# EAGLE design FireFaderRev1 (EAGLE 6.4)
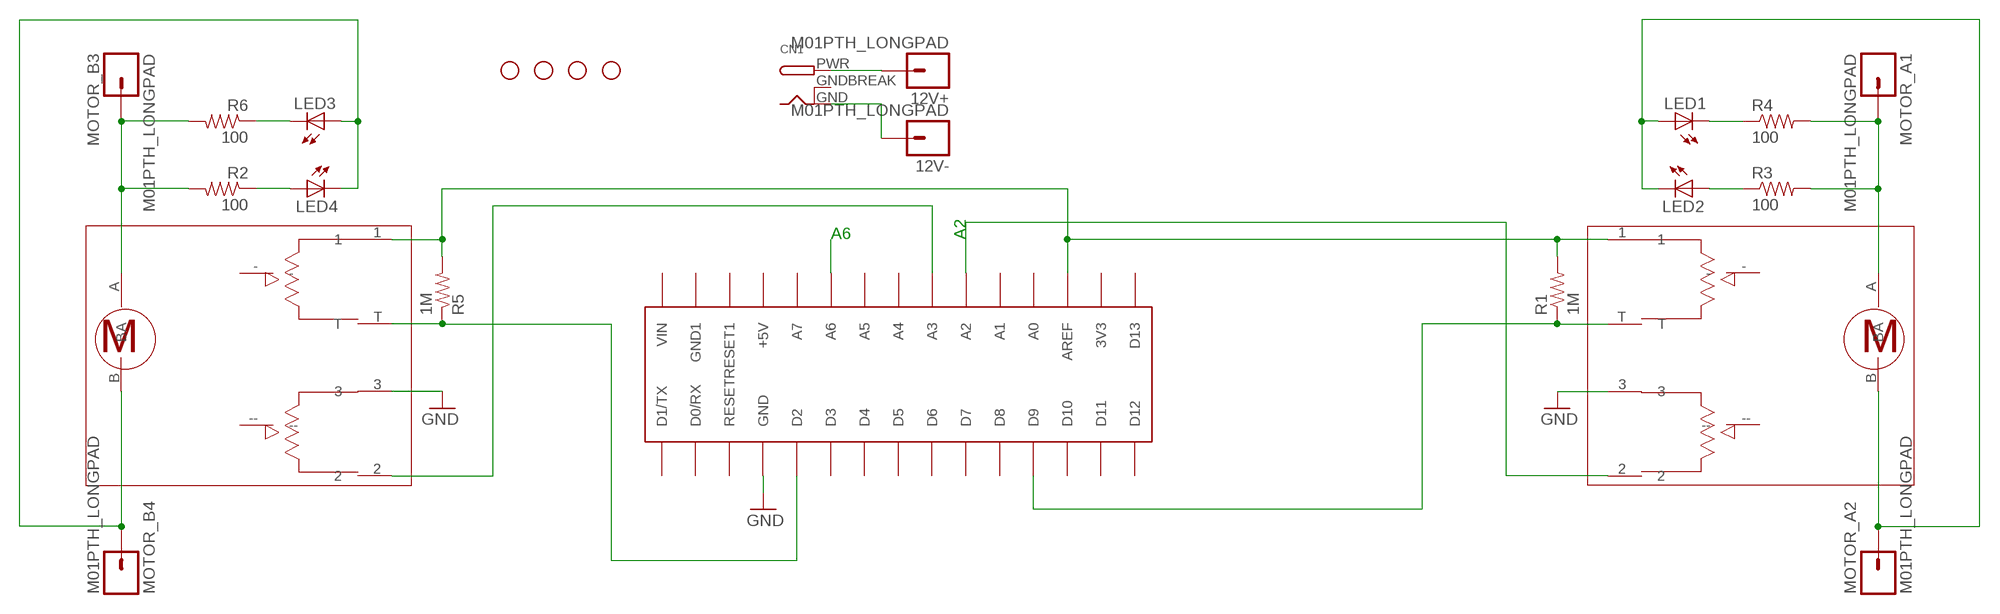
[diagram p0: schematic, sheet 1]

## Parts
12V+  M01PTH_LONGPAD  [1X01_LONGPAD]
12V-  M01PTH_LONGPAD  [1X01_LONGPAD]
CN1  DCBARRELPTH  [DCJACK_2MM_PTH]
LED1  LED5MM  [LED5MM]
LED2  LED5MM  [LED5MM]
LED3  LED5MM  [LED5MM]
LED4  LED5MM  [LED5MM]
MOTOR_A1  M01PTH_LONGPAD  [1X01_LONGPAD]
MOTOR_A2  M01PTH_LONGPAD  [1X01_LONGPAD]
MOTOR_B3  M01PTH_LONGPAD  [1X01_LONGPAD]
MOTOR_B4  M01PTH_LONGPAD  [1X01_LONGPAD]
R1  1M  RESISTORPTH-1/4W  [AXIAL-0.4]
R2  100  RESISTORPTH-1W  [AXIAL-0.6]
R3  100  RESISTORPTH-1W  [AXIAL-0.6]
R4  100  RESISTORPTH-1W  [AXIAL-0.6]
R5  1M  RESISTORPTH-1/4W  [AXIAL-0.4]
R6  100  RESISTORPTH-1W  [AXIAL-0.6]
STANDOFF1  STAND-OFF  [STAND-OFF]
STANDOFF2  STAND-OFF  [STAND-OFF]
STANDOFF3  STAND-OFF  [STAND-OFF]
STANDOFF4  STAND-OFF  [STAND-OFF]
U$1  ARDUINONANO  [PDIP-32]
U$2  ALPS-RSA0N11M9A07  [MF-MOTORFADER-ALPS]
U$3  ALPS-RSA0N11M9A07  [MF-MOTORFADER-ALPS]

## Nets
A1: U$1.A3 U$3.2
A2: U$1.A2 U$2.2
A6: U$1.A6
AREF: R1.P$2 R5.P$2 U$1.AREF U$2.1 U$3.1
GND: U$1.GND U$2.3 U$3.3
MA1: MOTOR_A1.1 R3.P$2 R4.P$2 U$2.A
MA2: LED1.A LED2.K(C) MOTOR_A2.1 U$2.B
MB3: MOTOR_B3.1 R2.P$2 R6.P$2 U$3.A
MB4: LED3.A LED4.K(C) MOTOR_B4.1 U$3.B
N$1: LED2.A R3.P$1
N$2: LED1.K(C) R4.P$1
N$7: R1.P$1 U$1.D9 U$2.T
N$9: 12V-.1 CN1.GND
N$10: 12V+.1 CN1.PWR
N$13: R5.P$1 U$1.D2 U$3.T
N$15: LED4.A R2.P$1
N$16: LED3.K(C) R6.P$1
Unconnected: U$1.3V3 U$1.+5V U$1.A0 U$1.A1 U$1.A4 U$1.A5 U$1.A7 U$1.D0/RX U$1.D1/TX U$1.D3 U$1.D4 U$1.D5 U$1.D6 U$1.D7 U$1.D8 U$1.D10 U$1.D11 U$1.D12 U$1.D13 U$1.GND1 U$1.RESET U$1.RESET1 U$1.VIN U$2.- U$2.-- U$3.- U$3.--

## Notes on the sheet
- A6 | A2

## Power pins joined to a net without a drawn wire
GNDBREAK: CN1.GNDBREAK

## Library data of the parts
12V+ 12V- MOTOR_A1 MOTOR_A2 MOTOR_B3 MOTOR_B4 = SparkFun-Connectors:M01: Header 1 Standard 1-pin 0.1" header. Use with straight break away headers (SKU : PRT-00116), right angle break away headers (PRT-00553), swiss pins (PRT-00743), machine pins (PRT-00117), and female headers (PRT-00115).
CN1 = adafruit:DCBARREL: 2.0mm DC Barrel Jack DCJACK_2MM_PTH - Through Hole Jack (4UConnector: 05537)
LED1-LED4 = SparkFun-LED:LED: LEDs Standard schematic elements and footprints for 5mm, 3mm, 1206, and 0603 sized LEDs. 5mm - Spark Fun Electronics SKU : COM-00529 (and others)
R1-R6 = SparkFun-Passives:RESISTOR: Resistor Basic schematic elements and footprints for 0603, 1206, and PTH resistors.
STANDOFF1-STANDOFF4 = SparkFun-Electromechanical:STAND-OFF: #4 Stand Off This is the mechanical footprint for a #4 phillips button head screw. Use the keepout ring to avoid running the screw head into surrounding components. SKU : PRT-00447
U$1 = jet-lib-fixed:ARDUINONANO
U$2 U$3 = ALPS-Motorfader:ALPS-RSA0N11M9A07: ALPS RSA0N11M9A07 100mm 10KOHM B Touchsensitiv Motorfader Datasheet: http://www.alps.com/WebObjects/catalog.woa/E/HTML/Potentiometer/SlidePotentiometers/RSN1M/RSA0N11M9A07.html

## Board
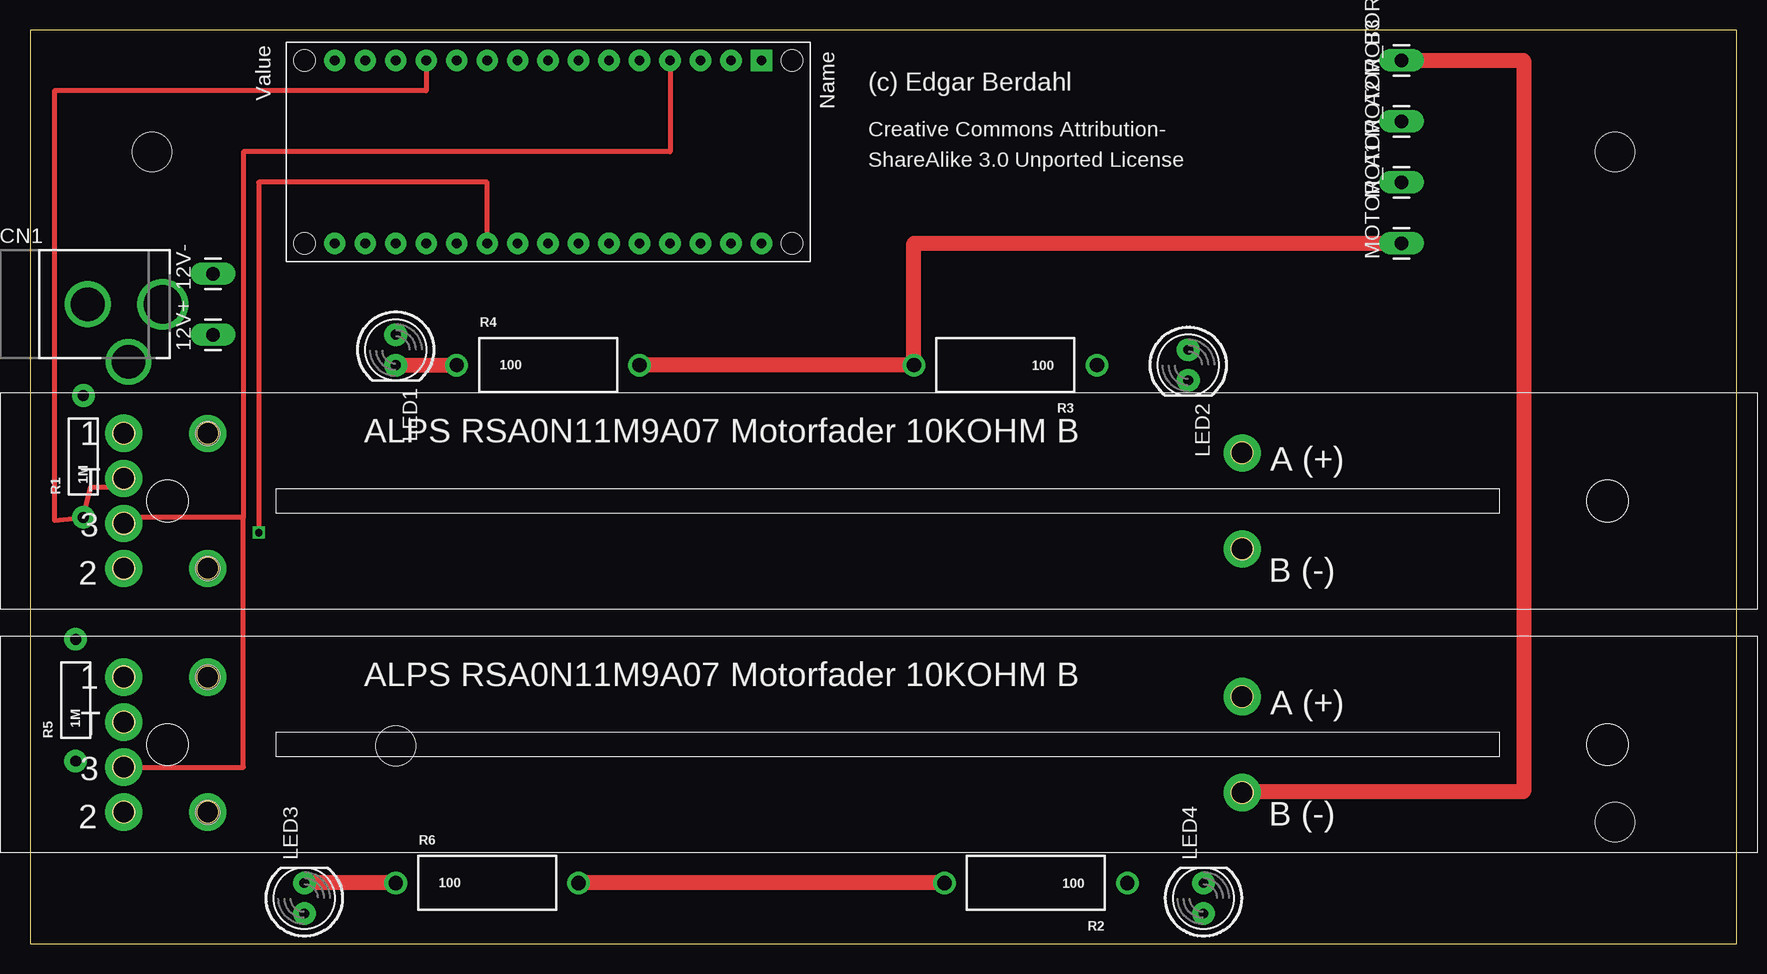
[diagram p1: board, top side]
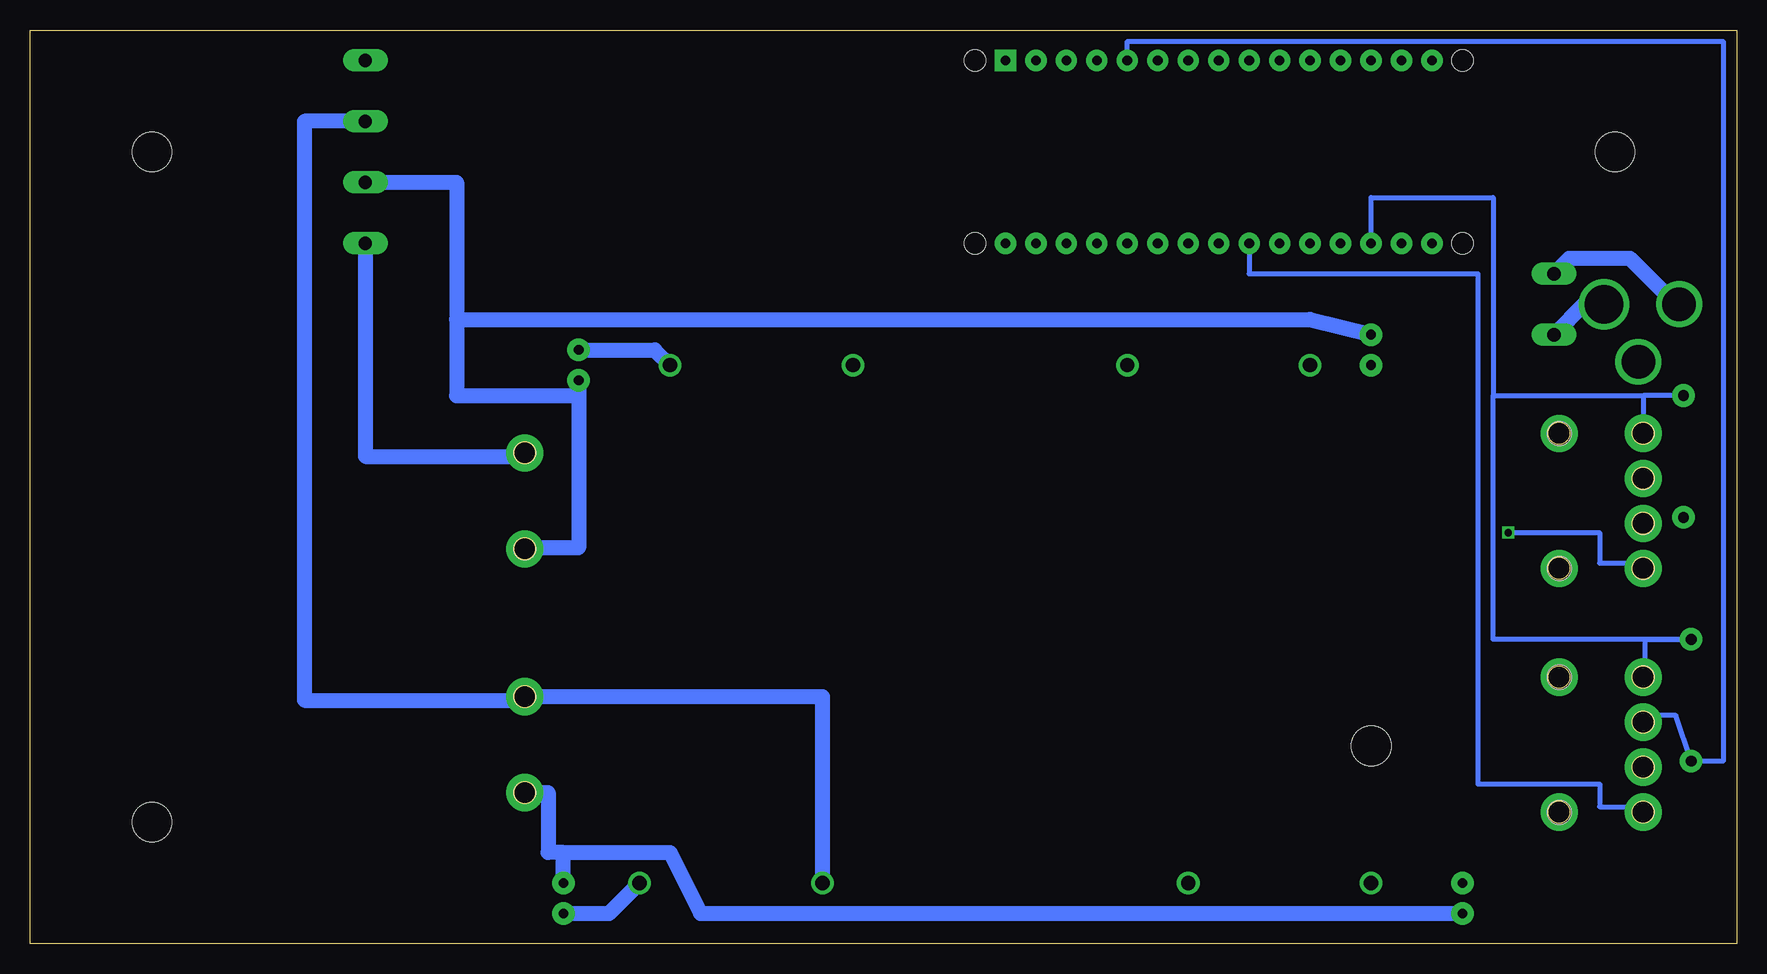
[diagram p2: board, bottom side, seen from below]

Size 142.24 x 76.2 mm. Coordinates in mm from the lower left corner, seen from the top.
Outline: 0,0 142.24,0 142.24,76.2 0,76.2 0,0
Copper layers (1*16): Top 0.035mm / dielectric 1.5mm / Bottom 0.035mm
Design rules "default *": minimum track width 50mil, minimum drill 24mil, track to track 8mil, track to pad 8mil, pad to pad 8mil, via to via 8mil, smd to smd 8mil, copper to edge 40mil, drill to drill 8mil, minimum pad ring 10mil, minimum via ring 8mil, stop-mask expansion 4mil, vias tented up to drill 0mil, thermal gap 10mil

### Footprints (pad centres in the part's own frame; a part is rotated, then mirrored left to right if it is on the bottom)
1X01_LONGPAD = drill 1.118 pad 1.88 long: 1 0,0
DCJACK_2MM_PTH = drill 2.8: GND 0,7.35; GNDBREAK 4.8,10.75 | drill 3.2: PWR 0,13.6
LED5MM = drill 0.813 pad 1.88: A -1.27,0; K 1.27,0
AXIAL-0.4 = drill 0.9 pad 1.88: P$1 -5.08,0; P$2 5.08,0
AXIAL-0.6 = drill 1.2 pad 1.88: P$1 -7.62,0; P$2 7.62,0
STAND-OFF = hole 3.302: 0,0
PDIP-32 = drill 0.8 pad 1.778: 3V3 15.24,-35.56; +5V 15.24,-10.16; A0 15.24,-30.48; A1 15.24,-27.94; A2 15.24,-25.4; A3 15.24,-22.86; A4 15.24,-20.32; A5 15.24,-17.78; A6 15.24,-15.24; A7 15.24,-12.7; AREF 15.24,-33.02; D0/RX 0,-5.08; D2 0,-12.7; D3 0,-15.24; D4 0,-17.78; D5 0,-20.32; D6 0,-22.86; D7 0,-25.4; D8 0,-27.94; D9 0,-30.48; D10 0,-33.02; D11 0,-35.56; D12 0,-38.1; D13 15.24,-38.1; GND 0,-10.16; GND1 15.24,-5.08; RESET 0,-7.62; RESET1 15.24,-7.62; VIN 15.24,-2.54 | drill 0.8 pad 1.778 square: D1/TX 0,-2.54 | hole 1.778: 0,0; 0,-40.64; 15.24,-40.64; 15.24,0
MF-MOTORFADER-ALPS = drill 1.85 pad 3.1: 1 10.351,14.628; 2 10.353,3.377; 3 10.352,7.122; - 17.35,14.624; -- 17.348,3.377; A 103.549,13.001; B 103.551,4.999; T 10.352,10.874 | hole 1.8: 10.349,14.636; 10.344,10.873; 10.345,7.119; 10.352,3.37; 103.555,4.991; 103.542,13.004 | hole 2: 17.352,3.363; 17.341,14.626

### Placement (x,y rotation side)
12V+  15.24,50.8 90 top
12V-  15.24,55.88 90 top
CN1  -2.54,53.34 270 top
LED1  30.48,49.53 270 top
LED2  96.52,48.26 270 top
LED3  22.86,3.81 90 top
LED4  97.79,3.81 90 top
MOTOR_A1  114.3,58.42 90 top
MOTOR_A2  114.3,63.5 90 top
MOTOR_B3  114.3,68.58 90 top
MOTOR_B4  114.3,73.66 90 top
R1  4.45,40.64 90 top
R2  83.82,5.08 180 top
R3  81.28,48.26 180 top
R4  43.18,48.26 0 top
R5  3.81,20.32 90 top
R6  38.1,5.08 0 top
STANDOFF1  30.48,16.51 0 top
STANDOFF2  10.16,66.04 0 top
STANDOFF3  132.08,10.16 0 top
STANDOFF4  132.08,66.04 0 top
U$1  63.5,73.66 270 top
U$2  -2.54,27.94 0 top
U$3  -2.54,7.62 0 top

### Tracks (layer width: path | path; a pad name or v marks a point on that pad's centre or on a via)
A1
  Bottom 0.406: U$1.A3 40.64,55.88 21.59,55.88 21.59,13.34 11.43,13.34 11.43,11.43 7.81,11.43 U$3.2
A2  (via drill 0.6)
  Top 0.406: U$1.A2 38.1,63.5 19.05,63.5 v19.05,34.29
  Bottom 0.406: v19.05,34.29 11.43,34.29 11.43,31.75 7.81,31.75 U$2.2
AREF
  Bottom 0.406: U$1.AREF 30.48,62.23 20.32,62.23 20.32,45.72 | 20.32,45.72 7.81,45.72 | 7.81,45.72 U$2.1 | R1.P$2 7.81,45.72 | U$3.1 7.62,22.25 7.62,25.4 R5.P$2 20.32,25.4 20.32,45.72
GND
  Top 0.406: U$1.GND 53.34,66.04 17.78,66.04 17.78,35.56 | 17.78,35.56 7.81,35.56 U$2.3 | U$3.3 17.78,14.74 17.78,35.56
MA1
  Top 1.27: R4.P$2 R3.P$2 73.66,58.42 MOTOR_A1.1
  Bottom 1.27: MOTOR_A1.1 114.3,40.64 101.01,40.64 U$2.A
MA2
  Bottom 1.27: LED1.A 35.56,52.07 106.68,52.07 | LED2.K 96.52,45.72 | 96.52,45.72 96.52,33.02 101.01,33.02 | 106.68,52.07 106.68,45.72 96.52,45.72 | 101.6,33.02 101.01,33.02 | 101.01,33.02 U$2.B | MOTOR_A2.1 106.68,63.5 106.68,52.07
MB3
  Top 1.27: R2.P$2 R6.P$2
  Bottom 1.27: MOTOR_B3.1 119.38,68.58 119.38,20.32 101.6,20.32 101.6,20.62 U$3.A 76.2,20.62 R2.P$2
MB4
  Top 1.27: MOTOR_B4.1 124.46,73.66 124.46,12.7 101.01,12.7 U$3.B
  Bottom 1.27: LED3.A 86.36,2.54 88.9,7.62 97.79,7.62 | 97.79,7.62 99.06,7.62 99.06,12.62 U$3.B | LED4.K 97.79,7.62
N$1
  Bottom 1.27: R3.P$1 90.17,49.53 LED2.A
N$2
  Top 1.27: LED1.K R4.P$1
N$7
  Top 0.406: U$1.D9 33.02,71.12 2.03,71.12 2.03,35.31 R1.P$1 5.08,38.1 7.81,38.1 U$2.T
N$9
  Bottom 1.27: 12V-.1 13.97,57.15 8.89,57.15 5.08,53.34 CN1.GND
N$10
  Bottom 1.27: 12V+.1 12.7,53.34 CN1.PWR
N$13
  Bottom 0.406: U$1.D2 50.8,75.25 1.14,75.25 1.14,15.24 R5.P$1 5.08,19.05 7.81,19.05 U$3.T
N$15
  Bottom 1.27: R2.P$1 93.98,2.54 LED4.A
N$16
  Top 1.27: R6.P$1 LED3.K

### Text on the board
tPlace: (c) Edgar Berdahl | Creative Commons Attribution- | ShareAlike 3.0 Unported License